# Altium schematic sheet SX1280 MID VELOCITY.SchDoc
size A4; SheetNumber: 3; SheetTotal: 5; SPICEModelCacheBULOLAEW: <root> / <DocumentId>BULOLAEW</DocumentId> / <CacheFrame Number="0"> / <Model Name="0603_885012206065_10nf" Kind="CKT"> / <Text>******* / .subckt 0603_885012206065_10nF 1 2 / Rser 1 3 0.05893 / Lser 2 4 0.00000000037916 / C1 3 4 0.00000001 / Rpar 3 4 10000000000 / .ends 0603_885012206065_10nF</Text> / </Model> / <Model Name="0603_885012206071_100nf" Kind="CKT"> / <Text>******* / .subckt 0603_885012206071_100nF 1 2 / Rser 1 3 0.025 / Lser 2 4 0.0000000008 / C1 3 4 0.0000001 / Rpar 3 4 5000000000 / .ends 0603_885012206071_100nF</Text> / </Model> / <Model Name="0603_885012206050_470nf" Kind="CKT"> / <Text>******* / .subckt 0603_885012206050_470nF 1 2 / Rser 1 3 0.00930503966198 / Lser 2 4 4.27988831E-10 / C1 3 4 0.00000047 / Rpar 3 4 1100000000 / .ends 0603_885012206050_470nF</Text> / </Model> / <Model Name="0603_885012006036_47pf" Kind="CKT"> / <Text>******* / .subckt 0603_885012006036_47pF 1 2 / Rser 1 3 0.062255914612 / Lser 2 4 4.24328623E-10 / C1 3 4 0.000000000047 / Rpar 3 4 10000000000 / .ends 0603_885012006036_47pF</Text> / </Model> / <Model Name="0603_885012106012_4.7uf" Kind="CKT"> / <Text>******* / .subckt 0603_885012106012_4.7uF 1 2 / Rser 1 3 0.00455496693599 / Lser 2 4 5.03384516E-10 / C1 3 4 0.0000047 / Rpar 3 4 20000000 / .ends 0603_885012106012_4.7uF</Text> / </Model> / <Model Name="0603_885012206052_1uf" Kind="CKT"> / <Text>******* / .subckt 0603_885012206052_1uF 1 2 / Rser 1 3 0.00742821402486 / Lser 2 4 2.51142993E-10 / C1 3 4 0.000001 / Rpar 3 4 100000000 / .ends 0603_885012206052_1uF</Text> / </Model> / <Model Name="0603_885012006057_100pf" Kind="CKT"> / <Text>******* / .subckt 0603_885012006057_100pF 1 2 / Rser 1 3 0.155626039874 / Lser 2 4 4.37579661E-10 / C1 3 4 0.0000000001 / Rpar 3 4 10000000000 / .ends 0603_885012006057_100pF</Text> / </Model> / </CacheFrame> / </root>
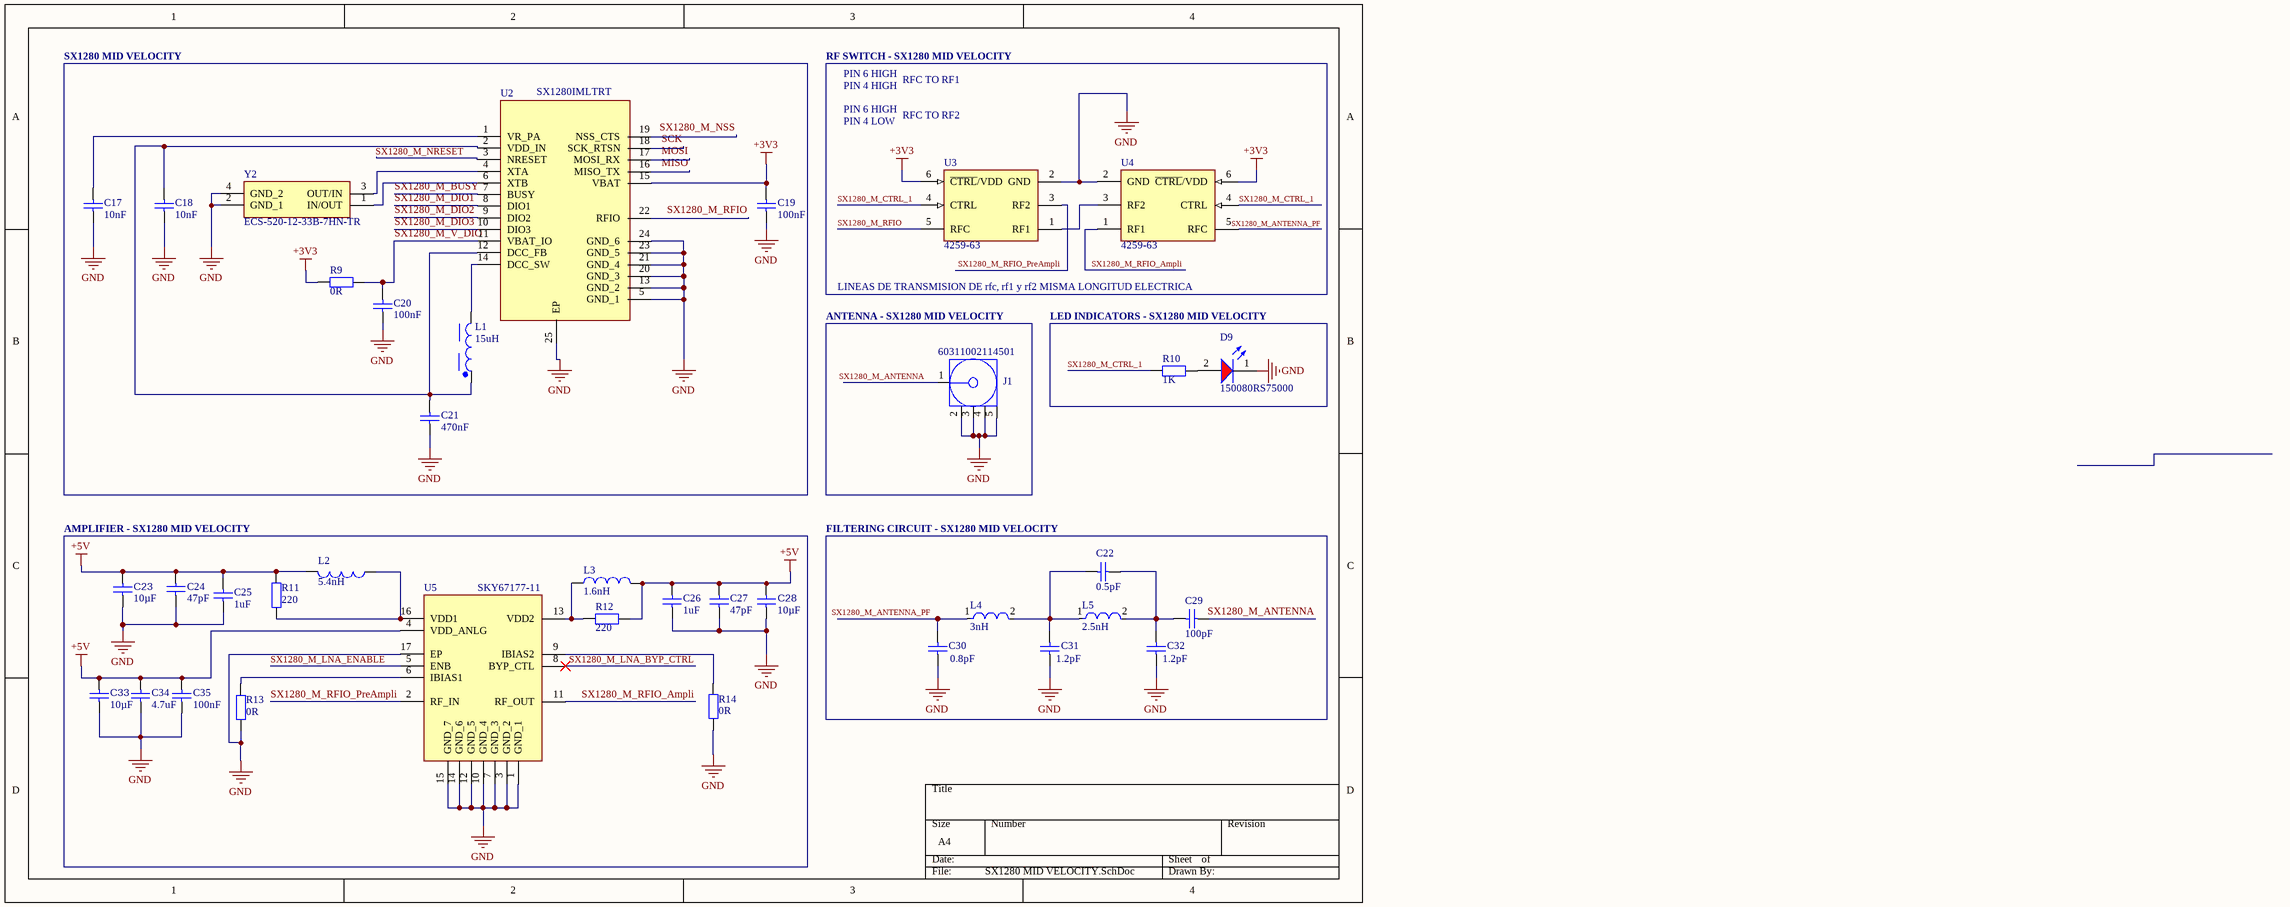
[diagram p0: SX1280 MID VELOCITY.SchDoc]

## Parts
C17  value 10nF  [WCAP-CSGP_0603_L1.6W0.8H0.8_Reflow]  (hidden comment: 885012206065)
C18  value 10nF  [WCAP-CSGP_0603_L1.6W0.8H0.8_Reflow]  (hidden comment: 885012206065)
C19  value 100nF  [WCAP-CSGP_0603_L1.6W0.8H0.8_Reflow]  (hidden comment: 885012206071)
C20  value 100nF  [WCAP-CSGP_0603_L1.6W0.8H0.8_Reflow]  (hidden comment: 885012206071)
C21  value 470nF  [WCAP-CSGP_0603_L1.6W0.8H0.8_Reflow]  (hidden comment: 885012206050)
C22  value 0.5pF  [WCAP-CSGP_0603_L1.6W0.8H0.8_Reflow]  (hidden comment: 885012006086)
C23  value 10µF  [GRM21BR61E106KA73K-Footprint-1]  (hidden comment: GRM21BR61E106KA73K)
C24  value 47pF  [WCAP-CSGP_0603_L1.6W0.8H0.8_Reflow]  (hidden comment: 885012006036)
C25  value 1uF  [WCAP-CSGP_0603_L1.6W0.8H0.8_Reflow]  (hidden comment: 885012206052)
C26  value 1uF  [WCAP-CSGP_0603_L1.6W0.8H0.8_Reflow]  (hidden comment: 885012206052)
C27  value 47pF  [WCAP-CSGP_0603_L1.6W0.8H0.8_Reflow]  (hidden comment: 885012006036)
C28  value 10µF  [GRM21BR61E106KA73K-Footprint-1]  (hidden comment: GRM21BR61E106KA73K)
C29  value 100pF  [WCAP-CSGP_0603_L1.6W0.8H0.8_Reflow]  (hidden comment: 885012006057)
C30  0.8pF  [WCAP-CSGP_0603_L1.6W0.8H0.8_Reflow]
C31  1.2pF  [WCAP-CSGP_0603_L1.6W0.8H0.8_Reflow]
C32  1.2pF  [WCAP-CSGP_0603_L1.6W0.8H0.8_Reflow]
C33  value 10µF  [GRM21BR61E106KA73K-Footprint-1]  (hidden comment: GRM21BR61E106KA73K)
C34  value 4.7uF  [WCAP-CSGP_0603_L1.6W0.8H0.8_Reflow]  (hidden comment: 885012106012)
C35  value 100nF  [WCAP-CSGP_0603_L1.6W0.8H0.8_Reflow]  (hidden comment: 885012206071)
D9  150080RS75000  [WL-SMCW_0805_150080xx75000]
J1  60311002114501  [60311002114501]
L1  Inductance: 15uH  [WE-LHCA_7030]  (hidden comment: 784373460150)
L2  5.4nH  [WE-KI_0603]
L3  1.6nH  [WE-KI_0603]
L4  3nH  [FP-LQW18AN_80-MFG]
L5  2.5nH  [FP-LQW18AN_80-MFG]
R9  0R  [WRIS-RSKS_0603_Reflow]
R10  value 1K  [WRIS-RSKS_0603_Reflow]  (hidden comment: 560112116014)
R11  value 220  [WRIS-RSKS_0603_Reflow]  (hidden comment: 560112116126)
R12  value 220  [WRIS-RSKS_0603_Reflow]  (hidden comment: 560112116126)
R13  0R  [WRIS-RSKS_0603_Reflow]
R14  0R  [WRIS-RSKS_0603_Reflow]
U2  SX1280IMLTRT  [SX1280IMLTRT-Footprint-1]
U3  4259-63  [PERE-SC-70-6_M]
U4  4259-63  [PERE-SC-70-6_M]
U5  SKY67177-11  [SKY67177-11-Footprint-1]
Y2  ECS-520-12-33B-7HN-TR  [ECS-520-12-33B-7HN-TR-Footprint-1]

## Blocks framed on the sheet
SX1280 MID VELOCITY: C17-C21 L1 R9 U2 Y2
ANTENNA - SX1280 MID VELOCITY: J1
LED INDICATORS - SX1280 MID VELOCITY: D9 R10
AMPLIFIER - SX1280 MID VELOCITY: C23-C28 C33-C35 L2 L3 R11-R14 U5
FILTERING CIRCUIT - SX1280 MID VELOCITY: C22 C29-C32 L4 L5

## Nets
+3V3: C19.2 R9.2 U2.15(VBAT) U3.6(~{CTRL}/VDD) U4.6(~{CTRL}/VDD)
+5V: C23.2 C24.1 C25.2 C26.2 C27.1 C28.2 C33.2 C34.2 C35.2 L2.2 L3.2 R11.2 R12.2 U5.4(VDD_ANLG)
GND: C17.1 C18.1 C19.1 C20.1 C21.1 C23.1 C24.2 C25.1 C26.1 C27.2 C28.1 C30.1 C31.1 C32.1 C33.1 C34.1 C35.1 D9.1(K) J1.2(GND) J1.3(GND) J1.4(GND) J1.5(GND) R13.1 R14.1 U2.5(GND_1) U2.13(GND_2) U2.20(GND_3) U2.21(GND_4) U2.23(GND_5) U2.24(GND_6) U2.25(EP) U3.2(GND) U4.2(GND) U5.1(GND_1) U5.3(GND_2) U5.7(GND_3) U5.10(GND_4) U5.12(GND_5) U5.14(GND_6) U5.15(GND_7) U5.17(EP) Y2.2(GND_1) Y2.4(GND_2)
MISO: U2.16(MISO_TX)
MOSI: U2.17(MOSI_RX)
SCK: U2.18(SCK_RTSN)
SX1280_M_ANTENNA: C29.2 J1.1(Signal)
SX1280_M_ANTENNA_PF: C30.2 L4.1 U4.5(RFC)
SX1280_M_BUSY: U2.7(BUSY)
SX1280_M_CTRL_1: R10.1 U3.4(CTRL) U4.4(CTRL)
SX1280_M_DIO1: U2.8(DIO1)
SX1280_M_DIO2: U2.9(DIO2)
SX1280_M_DIO3: U2.10(DIO3)
SX1280_M_LNA_BYP_CTRL: U5.8(BYP_CTL)
SX1280_M_LNA_ENABLE: U5.5(ENB)
SX1280_M_NRESET: U2.3(NRESET)
SX1280_M_NSS: U2.19(NSS_CTS)
SX1280_M_RFIO: U2.22(RFIO) U3.5(RFC)
SX1280_M_RFIO_Ampli: U4.1(RF1) U5.11(RF_OUT)
SX1280_M_RFIO_PreAmpli: U3.3(RF2) U5.2(RF_IN)
SX1280_M_V_DIO: C20.2 R9.1 U2.11(VBAT_IO)
NetC17_2: C17.2 U2.1(VR_PA)
NetC18_2: C18.2 C21.2 L1.1 U2.2(VDD_IN) U2.12(DCC_FB)
NetC22_1: C22.1 C31.2 L4.2 L5.1
NetC22_2: C22.2 C29.1 C32.2 L5.2
NetD9_2: D9.2(A) R10.2
NetL1_2: L1.2 U2.14(DCC_SW)
NetL2_1: L2.1 R11.1 U5.16(VDD1)
NetL3_1: L3.1 R12.1 U5.13(VDD2)
NetR13_2: R13.2 U5.6(IBIAS1)
NetR14_2: R14.2 U5.9(IBIAS2)
NetU2_4: U2.4(XTA) Y2.3(OUT/IN)
NetU2_6: U2.6(XTB) Y2.1(IN/OUT)
NetU3_1: U3.1(RF1) U4.3(RF2)

## Notes on the sheet
- RF SWITCH - SX1280 MID VELOCITY
- PIN 6 HIGH
- PIN 4 HIGH
- RFC TO RF1
- PIN 4 LOW
- RFC TO RF2
- LINEAS DE TRANSMISION DE rfc, rf1 y rf2 MISMA LONGITUD ELECTRICA

## Library data of the parts
C17 C18 = CMP-001-00655-1: WCAP-CSGP Multilayer Ceramic Chip Capacitor, General Purpose, size 0603, X7R, 10nF, 25VDC; Manufacturer: Wurth Elektronik; Dissipation Factor: 3.5%; Technical Reference: X7R0603103K025DFCT10000; Capacitance Tolerance: +/-10%; Insulation Resistance: 10GOhm; Rated Voltage (DC): 25V; ComponentLink1Description: Website Link; Packaging: Tape and Reel; Match Code: WCAP-CSGP; Ceramic Type: X7R; ComponentLink1URL: https://www.we-online.com/redexpert/article/885012206065?ad; ComponentLink2URL: https://www.we-online.com/redexpert/spec/885012206065?ad; Component Type: Standard; Case/Package: 0603; Operating Temperature Min: -55°C; ComponentLink2Description: Datasheet Link; Category: Multilayer Ceramic Chip Capacitors; Pins: 2; Mount: Surface Mount; Height: 0.8mm; Source: WCAP-CSGP.SchLib; Length: 1.6mm; Design Item ID: 885012206065; Operating Temperature Max: 125°C; Width: 0.8mm; Manufacturer Part Number: 885012206065
C19 C20 C35 = CMP-001-00661-1: WCAP-CSGP Multilayer Ceramic Chip Capacitor, General Purpose, size 0603, X7R, 100nF, 25VDC; Manufacturer: Wurth Elektronik; Dissipation Factor: 3.5%; Capacitance Tolerance: +/-10%; Insulation Resistance: 5GOhm; Technical Reference: X7R0603104K025DFCT10000; Rated Voltage (DC): 25V; Packaging: Tape and Reel; Height: 0.8mm; Mount: Surface Mount; Source: WCAP-CSGP.SchLib; Component Type: Standard; Category: Multilayer Ceramic Chip Capacitors; Operating Temperature Min: -55°C; Case/Package: 0603; ComponentLink2Description: Datasheet Link; Width: 0.8mm; ComponentLink1URL: https://www.we-online.com/redexpert/article/885012206071?ad; Length: 1.6mm; Operating Temperature Max: 125°C; Match Code: WCAP-CSGP; ComponentLink2URL: https://www.we-online.com/redexpert/spec/885012206071?ad; Design Item ID: 885012206071; ComponentLink1Description: Website Link; Manufacturer Part Number: 885012206071; Pins: 2; Ceramic Type: X7R
C21 = CMP-001-00640-1: WCAP-CSGP Multilayer Ceramic Chip Capacitor, General Purpose, size 0603, X7R, 470nF, 16VDC; Manufacturer: Wurth Elektronik; Insulation Resistance: 1.1GOhm; Dissipation Factor: 5%; Rated Voltage (DC): 16V; Capacitance Tolerance: +/-10%; Technical Reference: X7R0603474K016DFCT10000; Operating Temperature Max: 125°C; Width: 0.8mm; ComponentLink2URL: https://www.we-online.com/redexpert/spec/885012206050?ad; Packaging: Tape and Reel; Mount: Surface Mount; Case/Package: 0603; Operating Temperature Min: -55°C; Manufacturer Part Number: 885012206050; Category: Multilayer Ceramic Chip Capacitors; Component Type: Standard; Ceramic Type: X7R; Design Item ID: 885012206050; Pins: 2; Height: 0.8mm; ComponentLink2Description: Datasheet Link; ComponentLink1URL: https://www.we-online.com/redexpert/article/885012206050?ad; Length: 1.6mm; Match Code: WCAP-CSGP; ComponentLink1Description: Website Link; Source: WCAP-CSGP.SchLib
C22 = CMP-001-00191-1: WCAP-CSGP Multilayer Ceramic Chip Capacitor, General Purpose, size 0603, NP0, 0.5pF, 100VDC; Manufacturer: Wurth Elektronik; Technical Reference: NP00603R50C100DFCT10000; Capacitance Tolerance: +/-0.25pF; Rated Voltage (DC): 100V; Insulation Resistance: 10GOhm; Q Factor: 410; Height: 0.8mm; Packaging: Tape and Reel; ComponentLink2URL: https://www.we-online.com/redexpert/spec/885012006086?ad; Manufacturer Part Number: 885012006086; Operating Temperature Min: -55°C; ComponentLink1Description: Website Link; Match Code: WCAP-CSGP; Component Type: Standard; Category: Multilayer Ceramic Chip Capacitors; Source: WCAP-CSGP.SchLib; Length: 1.6mm; Case/Package: 0603; Mount: Surface Mount; ComponentLink1URL: https://www.we-online.com/redexpert/article/885012006086?ad; Width: 0.8mm; Ceramic Type: NP0; Operating Temperature Max: 125°C; Pins: 2; Design Item ID: 885012006086; ComponentLink2Description: Datasheet Link
C23 C28 C33 = CMP-001-00055-1: Ceramic Capacitor, Multilayer, Ceramic, 25V, 10% +Tol, 10% -Tol, X5R, 15% TC, 10uF, Surface Mount, 0805; Min Operating Temperature: -55°C; Pins: 2; Case/Package: 0805; RoHS Compliant: Yes; Mounting Technology: Surface Mount; Capacitor Type: Ceramic; Max Operating Temperature: 85°C
C24 C27 = CMP-001-00152-1: WCAP-CSGP Multilayer Ceramic Chip Capacitor, General Purpose, size 0603, NP0, 47pF, 25VDC; Manufacturer: Wurth Elektronik; Q Factor: 1000; Capacitance Tolerance: +/-5%; Insulation Resistance: 10GOhm; Technical Reference: NP00603470J025DFCT10000; Rated Voltage (DC): 25V; Operating Temperature Max: 125°C; ComponentLink2Description: Datasheet Link; Packaging: Tape and Reel; Ceramic Type: NP0; Height: 0.8mm; Mount: Surface Mount; Pins: 2; Source: WCAP-CSGP.SchLib; Case/Package: 0603; Component Type: Standard; Match Code: WCAP-CSGP; Length: 1.6mm; ComponentLink1Description: Website Link; Width: 0.8mm; Operating Temperature Min: -55°C; ComponentLink2URL: https://www.we-online.com/redexpert/spec/885012006036?ad; Category: Multilayer Ceramic Chip Capacitors; ComponentLink1URL: https://www.we-online.com/redexpert/article/885012006036?ad; Design Item ID: 885012006036; Manufacturer Part Number: 885012006036
C25 C26 = CMP-001-00642-1: WCAP-CSGP Multilayer Ceramic Chip Capacitor, General Purpose, size 0603, X7R, 1uF, 16VDC; Manufacturer: Wurth Elektronik; Capacitance Tolerance: +/-10%; Insulation Resistance: 0.1GOhm; Rated Voltage (DC): 16V; Dissipation Factor: 10%; Technical Reference: X7R0603105K016DFCT10000; Component Type: Standard; Width: 0.8mm; Ceramic Type: X7R; ComponentLink1Description: Website Link; ComponentLink1URL: https://www.we-online.com/redexpert/article/885012206052?ad; Height: 0.8mm; Manufacturer Part Number: 885012206052; Match Code: WCAP-CSGP; Source: WCAP-CSGP.SchLib; Case/Package: 0603; Operating Temperature Min: -55°C; ComponentLink2Description: Datasheet Link; Design Item ID: 885012206052; ComponentLink2URL: https://www.we-online.com/redexpert/spec/885012206052?ad; Category: Multilayer Ceramic Chip Capacitors; Packaging: Tape and Reel; Pins: 2; Length: 1.6mm; Operating Temperature Max: 125°C; Mount: Surface Mount
C29 = CMP-001-00173-1: WCAP-CSGP Multilayer Ceramic Chip Capacitor, General Purpose, size 0603, NP0, 100pF, 50VDC; Manufacturer: Wurth Elektronik; Technical Reference: NP00603101J050DFCT10000; Insulation Resistance: 10GOhm; Q Factor: 1000; Capacitance Tolerance: +/-5%; Rated Voltage (DC): 50V; Component Type: Standard; Design Item ID: 885012006057; ComponentLink1Description: Website Link; ComponentLink1URL: https://www.we-online.com/redexpert/article/885012006057?ad; Case/Package: 0603; Mount: Surface Mount; Width: 0.8mm; ComponentLink2URL: https://www.we-online.com/redexpert/spec/885012006057?ad; Pins: 2; Height: 0.8mm; ComponentLink2Description: Datasheet Link; Ceramic Type: NP0; Length: 1.6mm; Manufacturer Part Number: 885012006057; Operating Temperature Max: 125°C; Match Code: WCAP-CSGP; Category: Multilayer Ceramic Chip Capacitors; Packaging: Tape and Reel; Source: WCAP-CSGP.SchLib; Operating Temperature Min: -55°C
C30 = CMP-001-00661-1: Multilayer Ceramic Chip Capacitor, General Purpose, size 0603, X7R, 0.8pF, 50VDC, Tol=0.1pF; Manufacturer: TAIYO YUDEN; Manufacturer Part Number: MBASU063SCK0R8BFNA01; ComponentLink2Description: Datasheet Link; ComponentLink1URL: https://www.we-online.com/redexpert/article/885012206071?ad; ComponentLink2URL: https://www.we-online.com/redexpert/spec/885012206071?ad; ComponentLink1Description: Website Link
C31 C32 = CMP-001-00661-1: Multilayer Ceramic Chip Capacitor, General Purpose, size 0603, X7R, 1.2pF, 50VDC, Tol=0.1pF; Manufacturer: KYOCERA AVX; Manufacturer Part NUmber: 06035A1R2B4T2A; ComponentLink2Description: Datasheet Link; ComponentLink1URL: https://www.we-online.com/redexpert/article/885012206071?ad; ComponentLink2URL: https://www.we-online.com/redexpert/spec/885012206071?ad; ComponentLink1Description: Website Link
C34 = CMP-001-00440-1: WCAP-CSGP Multilayer Ceramic Chip Capacitor, General Purpose, size 0603, X5R, 4.7uF, 10VDC; Manufacturer: Wurth Elektronik; Rated Voltage (DC): 10V; Technical Reference: X5R0603475M010DFCT10000; Dissipation Factor: 10%; Insulation Resistance: 0.02GOhm; Capacitance Tolerance: +/-20%; ComponentLink2URL: https://www.we-online.com/redexpert/spec/885012106012?ad; Height: 0.8mm; Packaging: Tape and Reel; Case/Package: 0603; Manufacturer Part Number: 885012106012; Component Type: Standard; Width: 0.8mm; Match Code: WCAP-CSGP; Mount: Surface Mount; Ceramic Type: X5R; Operating Temperature Max: 85°C; ComponentLink1Description: Website Link; Length: 1.6mm; ComponentLink1URL: https://www.we-online.com/redexpert/article/885012106012?ad; ComponentLink2Description: Datasheet Link; Category: Multilayer Ceramic Chip Capacitors; Source: WCAP-CSGP.SchLib; Operating Temperature Min: -55°C; Pins: 2; Design Item ID: 885012106012
D9 = CMP-004-00453-1: WL-SMCW Mono-color Chip LED Waterclear, SMT, size 0805, Red, 2V, 140°; Manufacturer: Wurth Elektronik; Luminous Intensity: 150mcd; Peak Wavelength: 630nm; Chip Technology: AlInGaP; Dominant Wavelength: 625nm; ComponentLink2URL: https://www.we-online.com/redexpert/spec/150080RS75000?ad; Case/Package: 0805; Emitting Color: Red; Operating Temperature Max: 85°C; Match Code: WL-SMCW; Length: 2mm; ComponentLink1URL: https://www.we-online.com/redexpert/article/150080RS75000?ad; Mount: Surface Mount; Pins: 2; Manufacturer Part Number: 150080RS75000; Width: 1.25mm; Source: WL-SMCW.SchLib; ComponentLink1Description: Website Link; Component Type: Standard; Design Item ID: 150080RS75000; ComponentLink2Description: Datasheet Link; Height: 0.7mm; Operating Temperature Min: -40°C; Forward Voltage: 2V; Category: Signal LEDs; Packaging: Tape and Reel; Viewing Angle: 140°
J1 = CMP-03913-97004421-2: 60311002114501 Rf Coax Conn, Sma R/A Jack, 50 Ohm, Pcb Rohs Compliant: Yes; Insulation Resistance: 5GΩ; Insertion Loss (dB): 0.14dB; Impedance: 50Ω; Insulation Material: PTFE; Orientation: Right Angle; Min Operating Temperature: -65°C; Max Operating Temperature: 165°C; NexarPartId: 97004421; Connector Type: SMA
L1 = CMP-006-00671-1: WE-LHCA Low Profile High Current Inductor, SMT, size 7030, 15uH, 3A; Manufacturer: Wurth Elektronik; DC Resistance: 96mOhm; Saturation Current: 4.8A; Component Type: Standard; Design Item ID: 784373460150; ComponentLink2URL: https://www.we-online.com/redexpert/spec/784373460150?ad; ComponentLink1Description: Website Link; Manufacturer Part Number: 784373460150; Category: Power Inductors; Source: WE-LHCA.SchLib; Performance Rated Current: 3A; Packaging: Tape and Reel; ComponentLink2Description: Datasheet Link; Length: 6.95mm; ComponentLink1URL: https://www.we-online.com/redexpert/article/784373460150?ad; Width: 6.6mm; Match Code: WE-LHCA; Height: 2.8mm; Operating Temperature Max: 155°C; Operating Temperature Min: -55°C; Case/Package: 7030; Mount: Surface Mount; Pins: 2
L2 = CMP-03913-65277807-1: 744761056A Wirewound Inductor, 5.6Nh, 0.7A, 0603 Rohs Compliant: Yes; Current Rating: 700mA; Width: 1.05mm; Height: 1.05mm; Length: 1.6mm; Inductance: 5.6nH; Max Operating Temperature: 125°C; Min Operating Temperature: -40°C; RoHS: Compliant; Ambient Temperature Range High: 110°C; NexarPartId: 65277807; Ambient Temperature Range Low: -40°C
L3 = CMP-03913-22865515-1: 744761016A WE-KI SMT Wire Wound Ceramic Inductor; Q Factor: 40; Self Resonant Frequency: 12.5GHz; DC Resistance (DCR): 30mΩ; Inductance Tolerance: 5%; Max DC Current: 700mA; Case/Package: 0603; Packaging: Cut Tape; Width: 1.05mm; Length: 1.6mm; RoHS: Compliant; REACH SVHC: Unknown; Min Operating Temperature: -40°C; NexarPartId: 22865515; Mount: Surface Mount; Inductance: 1.6nH; Resistance: 30mΩ; Ambient Temperature Range Low: -40°C; Number of Pins: 2; Height: 1.05mm; Case Code (Metric): 1608; Current Rating: 700mA; Core Material: Ceramic; Case Code (Imperial): 0603; Max Operating Temperature: 125°C; Ambient Temperature Range High: 110°C
L4 = CMP-06042-001485-1: Wire Wound RF Inductor 3nH ±0.2nH 670mA 0.17Ω 0603 (1608); Shielding: Unshielded; Core Material: Non-Magnetic; DC Resistance (DCR): 170mR; Self Resonant Frequency: 15GHz; Test Frequency: 100MHz; Q Factor: 13; Packaging: Tape and Reel; Case Code (Imperial): 0603; Case Code (Metric): 1608; Length: 0.065inch; Min Operating Temperature: -55°C; Height - Seated (Max): 0.039inch; Current Rating: 670mA; Case/Package: 0603; Resistor Type: Wirewound; Weight: 7.1E-05oz; Max Operating Temperature: 125°C; Max DC Current: 670mA; Package Quantity: 4000; Inductance: 3nH; Width: 0.99mm; Mount: Surface Mount; Height: 0.9mm; Termination: SMD/SMT
L5 = CMP-06042-015805-1: Wire Wound RF Inductor 2.4nH ±0.2nH 2400mA 0.026Ω 0603 (1608); Self Resonant Frequency: 15GHz; DC Resistance (DCR): 26mR; Shielding: Unshielded; Current Rating: 2.4A; Test Frequency: 100MHz; Height - Seated (Max): 0.039inch; Mount: Surface Mount; Min Operating Temperature: -55°C; Inductance: 2.4nH; Width: 0.035inch; Length: 0.065inch; Packaging: Tape and Reel; Package Quantity: 4000; Case/Package: 0603; Max Operating Temperature: 125°C; Resistor Type: Wirewound
R9 R13 R14 = CMP-009-00324-1: WRIS-RSKS Thick Film Resistor, size 0603, 100mW; Manufacturer: Wurth Elektronik; Manufacturer Part Number: 560112116001; Height: 0.45mm; Case/Package: 0603; ComponentLink1Description: Website Link; Operating Temperature Min: -55°C; Mount: Surface Mount; ComponentLink1URL: https://www.we-online.com/redexpert/article/560112116001?ad; ComponentLink2URL: https://www.we-online.com/redexpert/spec/560112116001?ad; Packaging: Tape and Reel; Width: 0.8mm; Operating Temperature Max: 155°C; Source: WRIS-RSKS.SchLib; Category: Thick Film Resistors; Component Type: Standard; Rated Power: 100mW; ComponentLink2Description: Datasheet Link; Length: 1.6mm; Design Item ID: 560112116001; Pins: 2; Match Code: WRIS-RSKS
R10 = CMP-009-00337-1: WRIS-RSKS Thick Film Resistor, size 0603, 1000Ohm, 100mW; Manufacturer: Wurth Elektronik; Resistance Tolerance: +/-1%; Limiting Element Voltage: 75V; Temperature Coefficient of Resistance Min: -100ppm/°C; Temperature Coefficient of Resistance Max: 100ppm/°C; Mount: Surface Mount; Rated Power: 100mW; Packaging: Tape and Reel; Case/Package: 0603; ComponentLink1URL: https://www.we-online.com/redexpert/article/560112116014?ad; Height: 0.45mm; Manufacturer Part Number: 560112116014; ComponentLink1Description: Website Link; ComponentLink2URL: https://www.we-online.com/redexpert/spec/560112116014?ad; Source: WRIS-RSKS.SchLib; Operating Temperature Min: -55°C; Width: 0.8mm; Match Code: WRIS-RSKS; Design Item ID: 560112116014; ComponentLink2Description: Datasheet Link; Category: Thick Film Resistors; Operating Temperature Max: 155°C; Component Type: Standard; Length: 1.6mm; Pins: 2
R11 R12 = CMP-009-00449-1: WRIS-RSKS Thick Film Resistor, size 0603, 220Ohm, 100mW; Manufacturer: Wurth Elektronik; Temperature Coefficient of Resistance Max: 100ppm/°C; Limiting Element Voltage: 75V; Temperature Coefficient of Resistance Min: -100ppm/°C; Resistance Tolerance: +/-1%; ComponentLink2URL: https://www.we-online.com/redexpert/spec/560112116126?ad; Rated Power: 100mW; Source: WRIS-RSKS.SchLib; Packaging: Tape and Reel; Height: 0.45mm; Manufacturer Part Number: 560112116126; ComponentLink1URL: https://www.we-online.com/redexpert/article/560112116126?ad; Case/Package: 0603; Component Type: Standard; Operating Temperature Min: -55°C; Match Code: WRIS-RSKS; Length: 1.6mm; Category: Thick Film Resistors; Mount: Surface Mount; Width: 0.8mm; Design Item ID: 560112116126; ComponentLink2Description: Datasheet Link; Pins: 2; ComponentLink1Description: Website Link; Operating Temperature Max: 155°C
U2 = CMP-00025-00000-6: Telecom Circuit; RoHS Compliant: Yes
U3 U4 = CMP-2000-05298-1: IC RF Switch SPDT, 50 Ohm, 6-Pin SC70, RoHS, Tape and Reel; Manufacturer: Peregrine Semiconductor; P1dB: 29dBm(typ)IP1dB; Topology: Reflective; Frequency - Upper: 3GHz; Insertion Loss @ Frequency: 0.5dB@2GHz; IIP3: 55dBm(typ); Voltage - Supply: 1.8V~3.3V; Other Names: 1046-1011-24259-63-ND425963PE4259PE4259SCBC-ZPE4259SCBC-Z-ND; Isolation @ Frequency: 20dB@2GHz(typ); Frequency - Lower: 10MHz; Online Catalog: PE4259; Impedance: 50Ohm; RF Type: GeneralPurpose; Series: UltraCMOS; Manufacturer URL: http://www.psemi.com/; Package Description: 6-Pin Small Outline Transistor, Body 2.05 x 1.25 mm, Pitch 0.65 mm; Family: RFSwitches; Packaging: Tape&Reel(TR); Features: Single/DualLineControl; Package / Case: 6-TSSOP,SC-88,SOT-363; Operating Temperature: -40degC~85degC; Circuit: SPDT; Supplier Device Package: SC-70-6; Standard Package: 3,000; Datasheet URL: https://datasheet.ciiva.com/15100/getdatasheetpartid-685660-15100501.pdf; Category: RF/IFandRFID; Datasheet Version: Jan-11; Package Reference: SC-70-6
U5 = CMP-00025-00005-4: Amplificador de RF High Gain LNA
Y2 = CMP-003-00000-1: Crystals 52.000 MHz 12 pF ECS-33B +/-7/15 ppm -40 - +85C +/-1 ppm Aging 3225 4-SMD RoHS